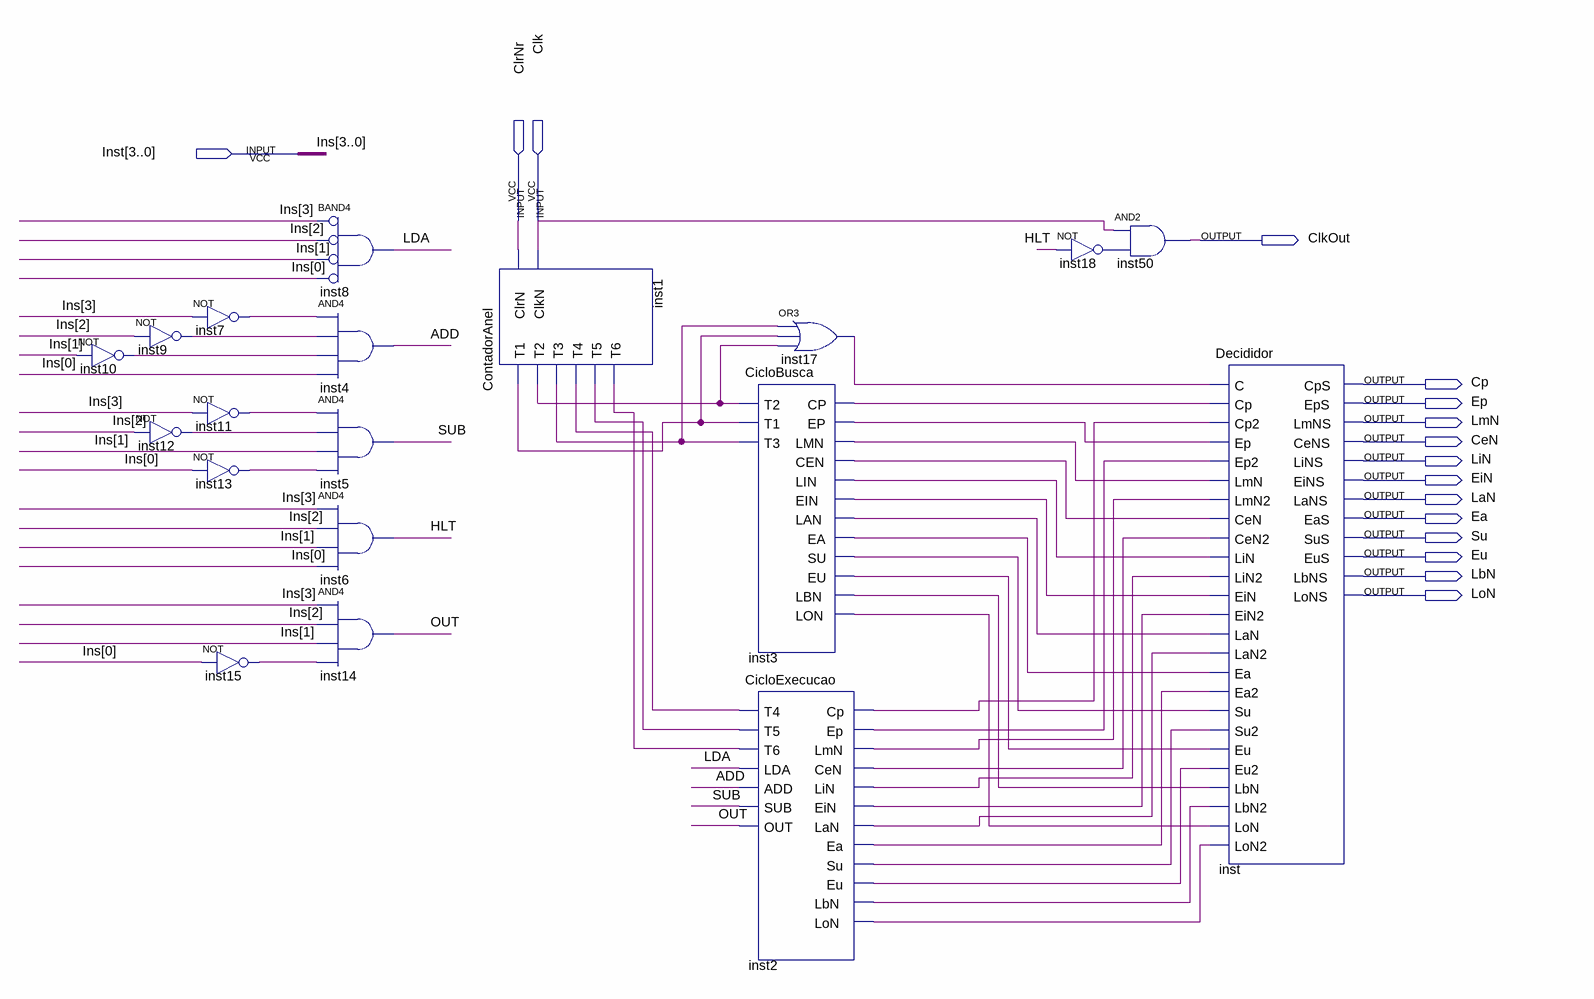
[diagram p0: schematic sheet]
// Quartus schematic Controlador.bdf as structural Verilog: 19 symbols, 16 pins
module Controlador (
  input  [3:0] Inst,
  input  ClrNr,
  input  Clk,
  output ClkOut,
  output Cp,
  output Ep,
  output LmN,
  output CeN,
  output LiN,
  output EiN,
  output LaN,
  output Ea,
  output Su,
  output Eu,
  output LbN,
  output LoN
);

  wire ADD, HLT, inst1_t1, inst1_t2, inst1_t3, inst1_t4, inst1_t5, inst1_t6, inst2_cen, inst2_cp, inst2_ea,
       inst2_ein, inst2_ep, inst2_eu, inst2_lan, inst2_lbn, inst2_lin, inst2_lmn, inst2_lon, inst2_su,
       inst3_cen, inst3_cp, inst3_ea, inst3_ein, inst3_ep, inst3_eu, inst3_lan, inst3_lbn, inst3_lin,
       inst3_lmn, inst3_lon, inst3_su, inst7_out, inst9_out, inst10_out, inst11_out, inst12_out, inst13_out,
       inst15_out, inst17_out, inst18_out, LDA, OUT, SUB;

  not inst10 (inst10_out, Inst[1]);
  not inst7 (inst7_out, Inst[3]);
  not inst9 (inst9_out, Inst[2]);
  not inst11 (inst11_out, Inst[3]);
  not inst12 (inst12_out, Inst[2]);
  not inst13 (inst13_out, Inst[0]);
  not inst15 (inst15_out, Inst[0]);
  and inst8 (LDA, ~Inst[3], ~Inst[2], ~Inst[1], ~Inst[0]);  // BAND4
  and inst4 (ADD, inst7_out, inst9_out, inst10_out, Inst[0]);
  and inst5 (SUB, inst11_out, inst12_out, Inst[1], inst13_out);
  and inst6 (HLT, Inst[3], Inst[2], Inst[1], Inst[0]);
  and inst14 (OUT, Inst[3], Inst[2], Inst[1], inst15_out);
  ContadorAnel inst1 (
    .ClrN(ClrNr), .ClkN(Clk), .T1(inst1_t1), .T2(inst1_t2), .T3(inst1_t3), .T4(inst1_t4), .T5(inst1_t5),
    .T6(inst1_t6));
  or inst17 (inst17_out, inst1_t3, inst1_t1, inst1_t2);
  CicloBusca inst3 (
    .T2(inst1_t2), .T1(inst1_t1), .T3(inst1_t3), .CP(inst3_cp), .EP(inst3_ep), .LMN(inst3_lmn),
    .CEN(inst3_cen), .LIN(inst3_lin), .EIN(inst3_ein), .LAN(inst3_lan), .EA(inst3_ea), .SU(inst3_su),
    .EU(inst3_eu), .LBN(inst3_lbn), .LON(inst3_lon));
  CicloExecucao inst2 (
    .T4(inst1_t4), .T5(inst1_t5), .T6(inst1_t6), .LDA(LDA), .ADD(ADD), .SUB(SUB), .OUT(OUT), .Cp(inst2_cp),
    .Ep(inst2_ep), .LmN(inst2_lmn), .CeN(inst2_cen), .LiN(inst2_lin), .EiN(inst2_ein), .LaN(inst2_lan),
    .Ea(inst2_ea), .Su(inst2_su), .Eu(inst2_eu), .LbN(inst2_lbn), .LoN(inst2_lon));
  and inst50 (ClkOut, Clk, inst18_out);
  not inst18 (inst18_out, HLT);
  Decididor u_inst (
    .C(inst17_out), .Cp(inst3_cp), .Cp2(inst2_cp), .Ep(inst3_ep), .Ep2(inst2_ep), .LmN(inst3_lmn),
    .LmN2(inst2_lmn), .CeN(inst3_cen), .CeN2(inst2_cen), .LiN(inst3_lin), .LiN2(inst2_lin), .EiN(inst3_ein),
    .EiN2(inst2_ein), .LaN(inst3_lan), .LaN2(inst2_lan), .Ea(inst3_ea), .Ea2(inst2_ea), .Su(inst3_su),
    .Su2(inst2_su), .Eu(inst3_eu), .Eu2(inst2_eu), .LbN(inst3_lbn), .LbN2(inst2_lbn), .LoN(inst3_lon),
    .LoN2(inst2_lon), .CpS(Cp), .EpS(Ep), .LmNS(LmN), .CeNS(CeN), .LiNS(LiN), .EiNS(EiN), .LaNS(LaN),
    .EaS(Ea), .SuS(Su), .EuS(Eu), .LbNS(LbN), .LoNS(LoN));

  // Other names for the same wires on the sheet: Ins[3:0] = Inst
endmodule
